# Altium schematic sheet CAN.SchDoc
size A4
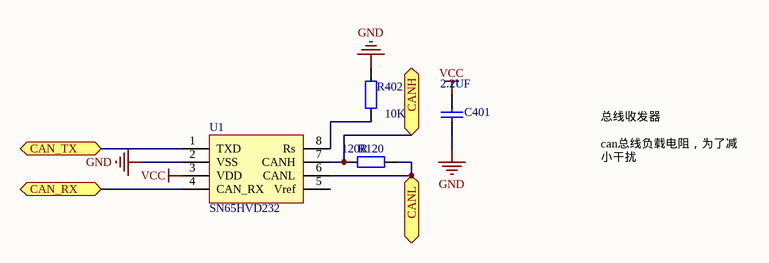
[diagram p0: CAN.SchDoc]

## Parts
C401  2.2UF  [C-0603]
R120  120R  [0603-2]
R402  10K  [0603-2]
U1  SN65HVD232  [SOIC8_N]

## Ports
CAN_RX, CAN_TX, CANH, CANL

## Nets
GND: C401.1 R402.2 U1.2(VSS)
VCC: C401.2 U1.3(VDD)
CAN_RX: U1.4(CAN_RX) ; port CAN_RX
CAN_TX: U1.1(TXD) ; port CAN_TX
CANH: R120.2 U1.7(CANH) ; port CANH
CANL: R120.1 U1.6(CANL) ; port CANL
NetR402_1: R402.1 U1.8(Rs)

Not connected (* = marked no-connect by the designer): U1 5(Vref)

## Notes on the sheet
- 总线收发器
  can总线负载电阻，为了减小干扰

## Library data of the parts
C401 = CAP: Capacitor; Published: 8-Jun-2000; Revision: July-2002: Re-released for DXP Platform.; Publisher: Altium Limited; Value: 2.2uF
R120 R402 = Res1: 贴片电阻; Published: 8-Jun-2000; LatestRevisionDate: 17-Jul-2002; LatestRevisionNote: Re-released for DXP Platform.; PackageReference: AXIAL-0.4; Publisher: Altium Limited
  R120: Value: 120R
  R402: Value: 10k
U1 = AT24C02_1: CAN收发器